# Altium project FMC_DIO_32ch_lvds_a.PrjPcb (part 2 of 2)
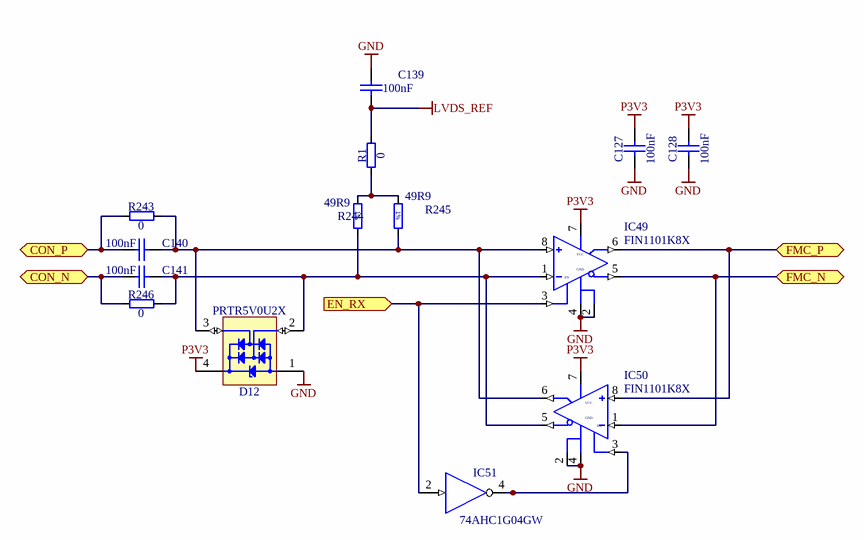
[diagram p4: fmc_digital_io_buffers.SchDoc]

## Nets that join several sheets
3P3VAUX: FMC_DIO_32ch_lvds_a (5 pins), fmc_digital_io_ipmi (C165.2 C166.2 IC61.8 IC62.8), fmc_digital_io_fmc_connector (J40.d32)
GND: FMC_DIO_32ch_lvds_a (82 pins), fmc_digital_io_ipmi (8 pins), fmc_digital_io_fmc_connector (62 pins), U_fmc_digital_io_buffers1 (9 pins), U_fmc_digital_io_buffers2 (9 pins), U_fmc_digital_io_buffers3 (9 pins), U_fmc_digital_io_buffers4 (9 pins), U_fmc_digital_io_buffers5 (9 pins), U_fmc_digital_io_buffers6 (9 pins), U_fmc_digital_io_buffers7 (9 pins), U_fmc_digital_io_buffers8 (9 pins), U_fmc_digital_io_buffers9 (9 pins), U_fmc_digital_io_buffers10 (9 pins), U_fmc_digital_io_buffers11 (9 pins), U_fmc_digital_io_buffers12 (9 pins), U_fmc_digital_io_buffers13 (9 pins), U_fmc_digital_io_buffers14 (9 pins), U_fmc_digital_io_buffers15 (9 pins), U_fmc_digital_io_buffers16 (9 pins), U_fmc_digital_io_buffers17 (9 pins), U_fmc_digital_io_buffers18 (9 pins), U_fmc_digital_io_buffers19 (9 pins), U_fmc_digital_io_buffers20 (9 pins), U_fmc_digital_io_buffers21 (9 pins), U_fmc_digital_io_buffers22 (9 pins), U_fmc_digital_io_buffers23 (9 pins), U_fmc_digital_io_buffers24 (9 pins), U_fmc_digital_io_buffers25 (9 pins), U_fmc_digital_io_buffers26 (9 pins), U_fmc_digital_io_buffers27 (9 pins), U_fmc_digital_io_buffers28 (9 pins), U_fmc_digital_io_buffers29 (9 pins), U_fmc_digital_io_buffers30 (9 pins), U_fmc_digital_io_buffers31 (9 pins), U_fmc_digital_io_buffers32 (9 pins)
LVDS_REF: FMC_DIO_32ch_lvds_a (8 pins), U_fmc_digital_io_buffers1 (C139A.2 R1A.2), U_fmc_digital_io_buffers2 (C139B.2 R1B.2), U_fmc_digital_io_buffers3 (C139C.2 R1C.2), U_fmc_digital_io_buffers4 (C139D.2 R1D.2), U_fmc_digital_io_buffers5 (C139E.2 R1E.2), U_fmc_digital_io_buffers6 (C139F.2 R1F.2), U_fmc_digital_io_buffers7 (C139G.2 R1G.2), U_fmc_digital_io_buffers8 (C139H.2 R1H.2), U_fmc_digital_io_buffers9 (C139I.2 R1I.2), U_fmc_digital_io_buffers10 (C139J.2 R1J.2), U_fmc_digital_io_buffers11 (C139K.2 R1K.2), U_fmc_digital_io_buffers12 (C139L.2 R1L.2), U_fmc_digital_io_buffers13 (C139M.2 R1M.2), U_fmc_digital_io_buffers14 (C139N.2 R1N.2), U_fmc_digital_io_buffers15 (C139O.2 R1O.2), U_fmc_digital_io_buffers16 (C139P.2 R1P.2), U_fmc_digital_io_buffers17 (C139Q.2 R1Q.2), U_fmc_digital_io_buffers18 (C139R.2 R1R.2), U_fmc_digital_io_buffers19 (C139S.2 R1S.2), U_fmc_digital_io_buffers20 (C139T.2 R1T.2), U_fmc_digital_io_buffers21 (C139U.2 R1U.2), U_fmc_digital_io_buffers22 (C139V.2 R1V.2), U_fmc_digital_io_buffers23 (C139W.2 R1W.2), U_fmc_digital_io_buffers24 (C139X.2 R1X.2), U_fmc_digital_io_buffers25 (C139Y.2 R1Y.2), U_fmc_digital_io_buffers26 (C139Z.2 R1Z.2), U_fmc_digital_io_buffers27 (C139[.2 R1[.2), U_fmc_digital_io_buffers28 (C139\.2 R1\.2), U_fmc_digital_io_buffers29 (C139].2 R1].2), U_fmc_digital_io_buffers30 (C139^.2 R1^.2), U_fmc_digital_io_buffers31 (C139_.2 R1_.2), U_fmc_digital_io_buffers32 (C139`.2 R1`.2)
P3V3: FMC_DIO_32ch_lvds_a (31 pins), fmc_digital_io_fmc_connector (J40.c39 J40.d36 J40.d38 J40.d40), U_fmc_digital_io_buffers1 (6 pins), U_fmc_digital_io_buffers2 (6 pins), U_fmc_digital_io_buffers3 (6 pins), U_fmc_digital_io_buffers4 (6 pins), U_fmc_digital_io_buffers5 (6 pins), U_fmc_digital_io_buffers6 (6 pins), U_fmc_digital_io_buffers7 (6 pins), U_fmc_digital_io_buffers8 (6 pins), U_fmc_digital_io_buffers9 (6 pins), U_fmc_digital_io_buffers10 (6 pins), U_fmc_digital_io_buffers11 (6 pins), U_fmc_digital_io_buffers12 (6 pins), U_fmc_digital_io_buffers13 (6 pins), U_fmc_digital_io_buffers14 (6 pins), U_fmc_digital_io_buffers15 (6 pins), U_fmc_digital_io_buffers16 (6 pins), U_fmc_digital_io_buffers17 (6 pins), U_fmc_digital_io_buffers18 (6 pins), U_fmc_digital_io_buffers19 (6 pins), U_fmc_digital_io_buffers20 (6 pins), U_fmc_digital_io_buffers21 (6 pins), U_fmc_digital_io_buffers22 (6 pins), U_fmc_digital_io_buffers23 (6 pins), U_fmc_digital_io_buffers24 (6 pins), U_fmc_digital_io_buffers25 (6 pins), U_fmc_digital_io_buffers26 (6 pins), U_fmc_digital_io_buffers27 (6 pins), U_fmc_digital_io_buffers28 (6 pins), U_fmc_digital_io_buffers29 (6 pins), U_fmc_digital_io_buffers30 (6 pins), U_fmc_digital_io_buffers31 (6 pins), U_fmc_digital_io_buffers32 (6 pins)
VADJ: FMC_DIO_32ch_lvds_a (C2.1 IC1.1 IC1.12), fmc_digital_io_fmc_connector (J40.g39 J40.h40)
CLK_VADJ: FMC_DIO_32ch_lvds_a (IC1.3), fmc_digital_io_fmc_connector (J40.h38)
CON1_N1: FMC_DIO_32ch_lvds_a (R267.2 R268.1), U_fmc_digital_io_buffers1 (C141A.1 R246A.1)
CON1_N2: FMC_DIO_32ch_lvds_a (R272.2 R273.1), U_fmc_digital_io_buffers2 (C141B.1 R246B.1)
CON1_N3: FMC_DIO_32ch_lvds_a (R277.2 R278.1), U_fmc_digital_io_buffers3 (C141C.1 R246C.1)
CON1_N4: FMC_DIO_32ch_lvds_a (R282.2 R283.1), U_fmc_digital_io_buffers4 (C141D.1 R246D.1)
CON1_N5: FMC_DIO_32ch_lvds_a (R287.2 R288.1), U_fmc_digital_io_buffers5 (C141E.1 R246E.1)
CON1_N6: FMC_DIO_32ch_lvds_a (J42.40), U_fmc_digital_io_buffers6 (C141F.1 R246F.1)
CON1_N7: FMC_DIO_32ch_lvds_a (J42.41), U_fmc_digital_io_buffers7 (C141G.1 R246G.1)
CON1_N8: FMC_DIO_32ch_lvds_a (J42.42), U_fmc_digital_io_buffers8 (C141H.1 R246H.1)
CON1_N9: FMC_DIO_32ch_lvds_a (J42.43), U_fmc_digital_io_buffers9 (C141I.1 R246I.1)
CON1_N10: FMC_DIO_32ch_lvds_a (J42.44), U_fmc_digital_io_buffers10 (C141J.1 R246J.1)
CON1_N11: FMC_DIO_32ch_lvds_a (J42.45), U_fmc_digital_io_buffers11 (C141K.1 R246K.1)
CON1_N12: FMC_DIO_32ch_lvds_a (J42.46), U_fmc_digital_io_buffers12 (C141L.1 R246L.1)
CON1_N13: FMC_DIO_32ch_lvds_a (J42.47), U_fmc_digital_io_buffers13 (C141M.1 R246M.1)
CON1_N14: FMC_DIO_32ch_lvds_a (J42.48), U_fmc_digital_io_buffers14 (C141N.1 R246N.1)
CON1_N15: FMC_DIO_32ch_lvds_a (J42.49), U_fmc_digital_io_buffers15 (C141O.1 R246O.1)
CON1_N16: FMC_DIO_32ch_lvds_a (J42.50), U_fmc_digital_io_buffers16 (C141P.1 R246P.1)
CON1_N17: FMC_DIO_32ch_lvds_a (J42.53), U_fmc_digital_io_buffers17 (C141Q.1 R246Q.1)
CON1_N18: FMC_DIO_32ch_lvds_a (J42.54), U_fmc_digital_io_buffers18 (C141R.1 R246R.1)
CON1_N19: FMC_DIO_32ch_lvds_a (J42.55), U_fmc_digital_io_buffers19 (C141S.1 R246S.1)
CON1_N20: FMC_DIO_32ch_lvds_a (J42.56), U_fmc_digital_io_buffers20 (C141T.1 R246T.1)
CON1_N21: FMC_DIO_32ch_lvds_a (J42.57), U_fmc_digital_io_buffers21 (C141U.1 R246U.1)
CON1_N22: FMC_DIO_32ch_lvds_a (J42.58), U_fmc_digital_io_buffers22 (C141V.1 R246V.1)
CON1_N23: FMC_DIO_32ch_lvds_a (J42.59), U_fmc_digital_io_buffers23 (C141W.1 R246W.1)
CON1_N24: FMC_DIO_32ch_lvds_a (J42.60), U_fmc_digital_io_buffers24 (C141X.1 R246X.1)
CON1_N25: FMC_DIO_32ch_lvds_a (J42.61), U_fmc_digital_io_buffers25 (C141Y.1 R246Y.1)
CON1_N26: FMC_DIO_32ch_lvds_a (J42.62), U_fmc_digital_io_buffers26 (C141Z.1 R246Z.1)
CON1_N27: FMC_DIO_32ch_lvds_a (J42.63), U_fmc_digital_io_buffers27 (C141[.1 R246[.1)
CON1_N28: FMC_DIO_32ch_lvds_a (J42.64), U_fmc_digital_io_buffers28 (C141\.1 R246\.1)
CON1_N29: FMC_DIO_32ch_lvds_a (J42.65), U_fmc_digital_io_buffers29 (C141].1 R246].1)
CON1_N30: FMC_DIO_32ch_lvds_a (J42.66), U_fmc_digital_io_buffers30 (C141^.1 R246^.1)
CON1_N31: FMC_DIO_32ch_lvds_a (J42.67), U_fmc_digital_io_buffers31 (C141_.1 R246_.1)
CON1_N32: FMC_DIO_32ch_lvds_a (J42.68), U_fmc_digital_io_buffers32 (C141`.1 R246`.1)
CON1_P1: FMC_DIO_32ch_lvds_a (R265.2 R266.1), U_fmc_digital_io_buffers1 (C140A.1 R243A.1)
CON1_P2: FMC_DIO_32ch_lvds_a (R270.2 R271.1), U_fmc_digital_io_buffers2 (C140B.1 R243B.1)
CON1_P3: FMC_DIO_32ch_lvds_a (R275.2 R276.1), U_fmc_digital_io_buffers3 (C140C.1 R243C.1)
CON1_P4: FMC_DIO_32ch_lvds_a (R280.2 R281.1), U_fmc_digital_io_buffers4 (C140D.1 R243D.1)
CON1_P5: FMC_DIO_32ch_lvds_a (R285.2 R286.1), U_fmc_digital_io_buffers5 (C140E.1 R243E.1)
CON1_P6: FMC_DIO_32ch_lvds_a (J42.6), U_fmc_digital_io_buffers6 (C140F.1 R243F.1)
CON1_P7: FMC_DIO_32ch_lvds_a (J42.7), U_fmc_digital_io_buffers7 (C140G.1 R243G.1)
CON1_P8: FMC_DIO_32ch_lvds_a (J42.8), U_fmc_digital_io_buffers8 (C140H.1 R243H.1)
CON1_P9: FMC_DIO_32ch_lvds_a (J42.9), U_fmc_digital_io_buffers9 (C140I.1 R243I.1)
CON1_P10: FMC_DIO_32ch_lvds_a (J42.10), U_fmc_digital_io_buffers10 (C140J.1 R243J.1)
CON1_P11: FMC_DIO_32ch_lvds_a (J42.11), U_fmc_digital_io_buffers11 (C140K.1 R243K.1)
CON1_P12: FMC_DIO_32ch_lvds_a (J42.12), U_fmc_digital_io_buffers12 (C140L.1 R243L.1)
CON1_P13: FMC_DIO_32ch_lvds_a (J42.13), U_fmc_digital_io_buffers13 (C140M.1 R243M.1)
CON1_P14: FMC_DIO_32ch_lvds_a (J42.14), U_fmc_digital_io_buffers14 (C140N.1 R243N.1)
CON1_P15: FMC_DIO_32ch_lvds_a (J42.15), U_fmc_digital_io_buffers15 (C140O.1 R243O.1)
CON1_P16: FMC_DIO_32ch_lvds_a (J42.16), U_fmc_digital_io_buffers16 (C140P.1 R243P.1)
CON1_P17: FMC_DIO_32ch_lvds_a (J42.19), U_fmc_digital_io_buffers17 (C140Q.1 R243Q.1)
CON1_P18: FMC_DIO_32ch_lvds_a (J42.20), U_fmc_digital_io_buffers18 (C140R.1 R243R.1)
CON1_P19: FMC_DIO_32ch_lvds_a (J42.21), U_fmc_digital_io_buffers19 (C140S.1 R243S.1)
CON1_P20: FMC_DIO_32ch_lvds_a (J42.22), U_fmc_digital_io_buffers20 (C140T.1 R243T.1)
CON1_P21: FMC_DIO_32ch_lvds_a (J42.23), U_fmc_digital_io_buffers21 (C140U.1 R243U.1)
CON1_P22: FMC_DIO_32ch_lvds_a (J42.24), U_fmc_digital_io_buffers22 (C140V.1 R243V.1)
CON1_P23: FMC_DIO_32ch_lvds_a (J42.25), U_fmc_digital_io_buffers23 (C140W.1 R243W.1)
CON1_P24: FMC_DIO_32ch_lvds_a (J42.26), U_fmc_digital_io_buffers24 (C140X.1 R243X.1)
CON1_P25: FMC_DIO_32ch_lvds_a (J42.27), U_fmc_digital_io_buffers25 (C140Y.1 R243Y.1)
CON1_P26: FMC_DIO_32ch_lvds_a (J42.28), U_fmc_digital_io_buffers26 (C140Z.1 R243Z.1)
CON1_P27: FMC_DIO_32ch_lvds_a (J42.29), U_fmc_digital_io_buffers27 (C140[.1 R243[.1)
CON1_P28: FMC_DIO_32ch_lvds_a (J42.30), U_fmc_digital_io_buffers28 (C140\.1 R243\.1)
CON1_P29: FMC_DIO_32ch_lvds_a (J42.31), U_fmc_digital_io_buffers29 (C140].1 R243].1)
CON1_P30: FMC_DIO_32ch_lvds_a (J42.32), U_fmc_digital_io_buffers30 (C140^.1 R243^.1)
CON1_P31: FMC_DIO_32ch_lvds_a (J42.33), U_fmc_digital_io_buffers31 (C140_.1 R243_.1)
CON1_P32: FMC_DIO_32ch_lvds_a (J42.34), U_fmc_digital_io_buffers32 (C140`.1 R243`.1)
EN1_RX1: FMC_DIO_32ch_lvds_a (IC56.1 R257.1), U_fmc_digital_io_buffers1 (IC49A.3 IC51A.2)
EN1_RX2: FMC_DIO_32ch_lvds_a (IC56.15 R256.1), U_fmc_digital_io_buffers2 (IC49B.3 IC51B.2)
EN1_RX3: FMC_DIO_32ch_lvds_a (IC56.3 R259.1), U_fmc_digital_io_buffers3 (IC49C.3 IC51C.2)
EN1_RX4: FMC_DIO_32ch_lvds_a (IC56.2 R258.1), U_fmc_digital_io_buffers4 (IC49D.3 IC51D.2)
EN1_RX5: FMC_DIO_32ch_lvds_a (IC56.5 R261.1), U_fmc_digital_io_buffers5 (IC49E.3 IC51E.2)
EN1_RX6: FMC_DIO_32ch_lvds_a (IC56.4 R260.1), U_fmc_digital_io_buffers6 (IC49F.3 IC51F.2)
EN1_RX7: FMC_DIO_32ch_lvds_a (IC56.7 R263.1), U_fmc_digital_io_buffers7 (IC49G.3 IC51G.2)
EN1_RX8: FMC_DIO_32ch_lvds_a (IC56.6 R262.1), U_fmc_digital_io_buffers8 (IC49H.3 IC51H.2)
EN1_RX9: FMC_DIO_32ch_lvds_a (IC57.1 R269.1), U_fmc_digital_io_buffers9 (IC49I.3 IC51I.2)
EN1_RX10: FMC_DIO_32ch_lvds_a (IC57.15 R264.1), U_fmc_digital_io_buffers10 (IC49J.3 IC51J.2)
EN1_RX11: FMC_DIO_32ch_lvds_a (IC57.3 R279.1), U_fmc_digital_io_buffers11 (IC49K.3 IC51K.2)
EN1_RX12: FMC_DIO_32ch_lvds_a (IC57.2 R274.1), U_fmc_digital_io_buffers12 (IC49L.3 IC51L.2)
EN1_RX13: FMC_DIO_32ch_lvds_a (IC57.5 R289.1), U_fmc_digital_io_buffers13 (IC49M.3 IC51M.2)
EN1_RX14: FMC_DIO_32ch_lvds_a (IC57.4 R284.1), U_fmc_digital_io_buffers14 (IC49N.3 IC51N.2)
EN1_RX15: FMC_DIO_32ch_lvds_a (IC57.7 R291.1), U_fmc_digital_io_buffers15 (IC49O.3 IC51O.2)
EN1_RX16: FMC_DIO_32ch_lvds_a (IC57.6 R290.1), U_fmc_digital_io_buffers16 (IC49P.3 IC51P.2)
EN1_RX17: FMC_DIO_32ch_lvds_a (IC58.1 R293.1), U_fmc_digital_io_buffers17 (IC49Q.3 IC51Q.2)
EN1_RX18: FMC_DIO_32ch_lvds_a (IC58.15 R292.1), U_fmc_digital_io_buffers18 (IC49R.3 IC51R.2)
EN1_RX19: FMC_DIO_32ch_lvds_a (IC58.3 R295.1), U_fmc_digital_io_buffers19 (IC49S.3 IC51S.2)
EN1_RX20: FMC_DIO_32ch_lvds_a (IC58.2 R294.1), U_fmc_digital_io_buffers20 (IC49T.3 IC51T.2)
EN1_RX21: FMC_DIO_32ch_lvds_a (IC58.5 R297.1), U_fmc_digital_io_buffers21 (IC49U.3 IC51U.2)
EN1_RX22: FMC_DIO_32ch_lvds_a (IC58.4 R296.1), U_fmc_digital_io_buffers22 (IC49V.3 IC51V.2)
EN1_RX23: FMC_DIO_32ch_lvds_a (IC58.7 R299.1), U_fmc_digital_io_buffers23 (IC49W.3 IC51W.2)
EN1_RX24: FMC_DIO_32ch_lvds_a (IC58.6 R298.1), U_fmc_digital_io_buffers24 (IC49X.3 IC51X.2)
EN1_RX25: FMC_DIO_32ch_lvds_a (IC59.1 R301.1), U_fmc_digital_io_buffers25 (IC49Y.3 IC51Y.2)
EN1_RX26: FMC_DIO_32ch_lvds_a (IC59.15 R300.1), U_fmc_digital_io_buffers26 (IC49Z.3 IC51Z.2)
EN1_RX27: FMC_DIO_32ch_lvds_a (IC59.3 R303.1), U_fmc_digital_io_buffers27 (IC49[.3 IC51[.2)
EN1_RX28: FMC_DIO_32ch_lvds_a (IC59.2 R302.1), U_fmc_digital_io_buffers28 (IC49\.3 IC51\.2)
EN1_RX29: FMC_DIO_32ch_lvds_a (IC59.5 R305.1), U_fmc_digital_io_buffers29 (IC49].3 IC51].2)
EN1_RX30: FMC_DIO_32ch_lvds_a (IC59.4 R304.1), U_fmc_digital_io_buffers30 (IC49^.3 IC51^.2)
EN1_RX31: FMC_DIO_32ch_lvds_a (IC59.7 R307.1), U_fmc_digital_io_buffers31 (IC49_.3 IC51_.2)
EN1_RX32: FMC_DIO_32ch_lvds_a (IC59.6 R306.1), U_fmc_digital_io_buffers32 (IC49`.3 IC51`.2)
FMC1_N1: fmc_digital_io_fmc_connector (J40.g7), U_fmc_digital_io_buffers1 (IC49A.5 IC50A.1)
FMC1_N2: fmc_digital_io_fmc_connector (J40.d9), U_fmc_digital_io_buffers2 (IC49B.5 IC50B.1)
FMC1_N3: fmc_digital_io_fmc_connector (J40.h8), U_fmc_digital_io_buffers3 (IC49C.5 IC50C.1)
FMC1_N4: fmc_digital_io_fmc_connector (J40.g10), U_fmc_digital_io_buffers4 (IC49D.5 IC50D.1)
FMC1_N5: fmc_digital_io_fmc_connector (J40.h11), U_fmc_digital_io_buffers5 (IC49E.5 IC50E.1)
FMC1_N6: fmc_digital_io_fmc_connector (J40.d12), U_fmc_digital_io_buffers6 (IC49F.5 IC50F.1)
FMC1_N7: fmc_digital_io_fmc_connector (J40.c11), U_fmc_digital_io_buffers7 (IC49G.5 IC50G.1)
FMC1_N8: fmc_digital_io_fmc_connector (J40.h14), U_fmc_digital_io_buffers8 (IC49H.5 IC50H.1)
FMC1_N9: fmc_digital_io_fmc_connector (J40.g13), U_fmc_digital_io_buffers9 (IC49I.5 IC50I.1)
FMC1_N10: fmc_digital_io_fmc_connector (J40.d15), U_fmc_digital_io_buffers10 (IC49J.5 IC50J.1)
FMC1_N11: fmc_digital_io_fmc_connector (J40.c15), U_fmc_digital_io_buffers11 (IC49K.5 IC50K.1)
FMC1_N12: fmc_digital_io_fmc_connector (J40.h17), U_fmc_digital_io_buffers12 (IC49L.5 IC50L.1)
FMC1_N13: fmc_digital_io_fmc_connector (J40.g16), U_fmc_digital_io_buffers13 (IC49M.5 IC50M.1)
FMC1_N14: fmc_digital_io_fmc_connector (J40.d18), U_fmc_digital_io_buffers14 (IC49N.5 IC50N.1)
FMC1_N15: fmc_digital_io_fmc_connector (J40.c19), U_fmc_digital_io_buffers15 (IC49O.5 IC50O.1)
FMC1_N16: fmc_digital_io_fmc_connector (J40.h20), U_fmc_digital_io_buffers16 (IC49P.5 IC50P.1)
FMC1_N17: fmc_digital_io_fmc_connector (J40.g19), U_fmc_digital_io_buffers17 (IC49Q.5 IC50Q.1)
FMC1_N18: fmc_digital_io_fmc_connector (J40.d21), U_fmc_digital_io_buffers18 (IC49R.5 IC50R.1)
FMC1_N19: fmc_digital_io_fmc_connector (J40.c23), U_fmc_digital_io_buffers19 (IC49S.5 IC50S.1)
FMC1_N20: fmc_digital_io_fmc_connector (J40.h23), U_fmc_digital_io_buffers20 (IC49T.5 IC50T.1)
FMC1_N21: fmc_digital_io_fmc_connector (J40.g22), U_fmc_digital_io_buffers21 (IC49U.5 IC50U.1)
FMC1_N22: fmc_digital_io_fmc_connector (J40.h26), U_fmc_digital_io_buffers22 (IC49V.5 IC50V.1)
FMC1_N23: fmc_digital_io_fmc_connector (J40.g25), U_fmc_digital_io_buffers23 (IC49W.5 IC50W.1)
FMC1_N24: fmc_digital_io_fmc_connector (J40.d24), U_fmc_digital_io_buffers24 (IC49X.5 IC50X.1)
FMC1_N25: fmc_digital_io_fmc_connector (J40.h29), U_fmc_digital_io_buffers25 (IC49Y.5 IC50Y.1)
FMC1_N26: fmc_digital_io_fmc_connector (J40.g28), U_fmc_digital_io_buffers26 (IC49Z.5 IC50Z.1)
FMC1_N27: fmc_digital_io_fmc_connector (J40.d27), U_fmc_digital_io_buffers27 (IC49[.5 IC50[.1)
FMC1_N28: fmc_digital_io_fmc_connector (J40.c27), U_fmc_digital_io_buffers28 (IC49\.5 IC50\.1)
FMC1_N29: fmc_digital_io_fmc_connector (J40.h32), U_fmc_digital_io_buffers29 (IC49].5 IC50].1)
FMC1_N30: fmc_digital_io_fmc_connector (J40.g31), U_fmc_digital_io_buffers30 (IC49^.5 IC50^.1)
FMC1_N31: fmc_digital_io_fmc_connector (J40.h35), U_fmc_digital_io_buffers31 (IC49_.5 IC50_.1)
FMC1_N32: fmc_digital_io_fmc_connector (J40.g34), U_fmc_digital_io_buffers32 (IC49`.5 IC50`.1)
FMC1_P1: fmc_digital_io_fmc_connector (J40.g6), U_fmc_digital_io_buffers1 (IC49A.6 IC50A.8)
FMC1_P2: fmc_digital_io_fmc_connector (J40.d8), U_fmc_digital_io_buffers2 (IC49B.6 IC50B.8)
FMC1_P3: fmc_digital_io_fmc_connector (J40.h7), U_fmc_digital_io_buffers3 (IC49C.6 IC50C.8)
FMC1_P4: fmc_digital_io_fmc_connector (J40.g9), U_fmc_digital_io_buffers4 (IC49D.6 IC50D.8)
FMC1_P5: fmc_digital_io_fmc_connector (J40.h10), U_fmc_digital_io_buffers5 (IC49E.6 IC50E.8)
FMC1_P6: fmc_digital_io_fmc_connector (J40.d11), U_fmc_digital_io_buffers6 (IC49F.6 IC50F.8)
FMC1_P7: fmc_digital_io_fmc_connector (J40.c10), U_fmc_digital_io_buffers7 (IC49G.6 IC50G.8)
FMC1_P8: fmc_digital_io_fmc_connector (J40.h13), U_fmc_digital_io_buffers8 (IC49H.6 IC50H.8)
FMC1_P9: fmc_digital_io_fmc_connector (J40.g12), U_fmc_digital_io_buffers9 (IC49I.6 IC50I.8)
FMC1_P10: fmc_digital_io_fmc_connector (J40.d14), U_fmc_digital_io_buffers10 (IC49J.6 IC50J.8)
FMC1_P11: fmc_digital_io_fmc_connector (J40.c14), U_fmc_digital_io_buffers11 (IC49K.6 IC50K.8)
FMC1_P12: fmc_digital_io_fmc_connector (J40.h16), U_fmc_digital_io_buffers12 (IC49L.6 IC50L.8)
FMC1_P13: fmc_digital_io_fmc_connector (J40.g15), U_fmc_digital_io_buffers13 (IC49M.6 IC50M.8)
FMC1_P14: fmc_digital_io_fmc_connector (J40.d17), U_fmc_digital_io_buffers14 (IC49N.6 IC50N.8)
FMC1_P15: fmc_digital_io_fmc_connector (J40.c18), U_fmc_digital_io_buffers15 (IC49O.6 IC50O.8)
FMC1_P16: fmc_digital_io_fmc_connector (J40.h19), U_fmc_digital_io_buffers16 (IC49P.6 IC50P.8)
FMC1_P17: fmc_digital_io_fmc_connector (J40.g18), U_fmc_digital_io_buffers17 (IC49Q.6 IC50Q.8)
FMC1_P18: fmc_digital_io_fmc_connector (J40.d20), U_fmc_digital_io_buffers18 (IC49R.6 IC50R.8)
FMC1_P19: fmc_digital_io_fmc_connector (J40.c22), U_fmc_digital_io_buffers19 (IC49S.6 IC50S.8)
FMC1_P20: fmc_digital_io_fmc_connector (J40.h22), U_fmc_digital_io_buffers20 (IC49T.6 IC50T.8)
FMC1_P21: fmc_digital_io_fmc_connector (J40.g21), U_fmc_digital_io_buffers21 (IC49U.6 IC50U.8)
FMC1_P22: fmc_digital_io_fmc_connector (J40.h25), U_fmc_digital_io_buffers22 (IC49V.6 IC50V.8)
FMC1_P23: fmc_digital_io_fmc_connector (J40.g24), U_fmc_digital_io_buffers23 (IC49W.6 IC50W.8)
FMC1_P24: fmc_digital_io_fmc_connector (J40.d23), U_fmc_digital_io_buffers24 (IC49X.6 IC50X.8)
FMC1_P25: fmc_digital_io_fmc_connector (J40.h28), U_fmc_digital_io_buffers25 (IC49Y.6 IC50Y.8)
FMC1_P26: fmc_digital_io_fmc_connector (J40.g27), U_fmc_digital_io_buffers26 (IC49Z.6 IC50Z.8)
FMC1_P27: fmc_digital_io_fmc_connector (J40.d26), U_fmc_digital_io_buffers27 (IC49[.6 IC50[.8)
FMC1_P28: fmc_digital_io_fmc_connector (J40.c26), U_fmc_digital_io_buffers28 (IC49\.6 IC50\.8)
FMC1_P29: fmc_digital_io_fmc_connector (J40.h31), U_fmc_digital_io_buffers29 (IC49].6 IC50].8)
FMC1_P30: fmc_digital_io_fmc_connector (J40.g30), U_fmc_digital_io_buffers30 (IC49^.6 IC50^.8)
FMC1_P31: fmc_digital_io_fmc_connector (J40.h34), U_fmc_digital_io_buffers31 (IC49_.6 IC50_.8)
FMC1_P32: fmc_digital_io_fmc_connector (J40.g33), U_fmc_digital_io_buffers32 (IC49`.6 IC50`.8)
GA0: fmc_digital_io_ipmi (IC61.2 IC62.6), fmc_digital_io_fmc_connector (J40.c34)
GA1: fmc_digital_io_ipmi (IC61.1 IC62.7), fmc_digital_io_fmc_connector (J40.d35)
LA32_P: FMC_DIO_32ch_lvds_a (IC1.2 R2.2), fmc_digital_io_fmc_connector (J40.h37)
LA33_N: FMC_DIO_32ch_lvds_a (IC1.5), fmc_digital_io_fmc_connector (J40.g37)
LA33_P: FMC_DIO_32ch_lvds_a (IC1.4), fmc_digital_io_fmc_connector (J40.g36)
SCL: FMC_DIO_32ch_lvds_a (IC60.3), fmc_digital_io_ipmi (IC61.6 IC62.2), fmc_digital_io_fmc_connector (J40.c30)
SDA: FMC_DIO_32ch_lvds_a (IC60.6), fmc_digital_io_ipmi (IC61.5 IC62.1), fmc_digital_io_fmc_connector (J40.c31)

## Assembly variants
VHDCI only: not fitted F6 IC55 J41 R1[ R1\ R1] R1^ R1_ R1` R1A R1B R1C R1D R1E R1F R1G R1H R1I R1J R1K R1L R1M R1N R1O R1P R1Q R1R R1S R1T R1U R1V R1W R1X R1Y R1Z R265 R268 R270 R273 R275 R278 R280 R283 R285 R288